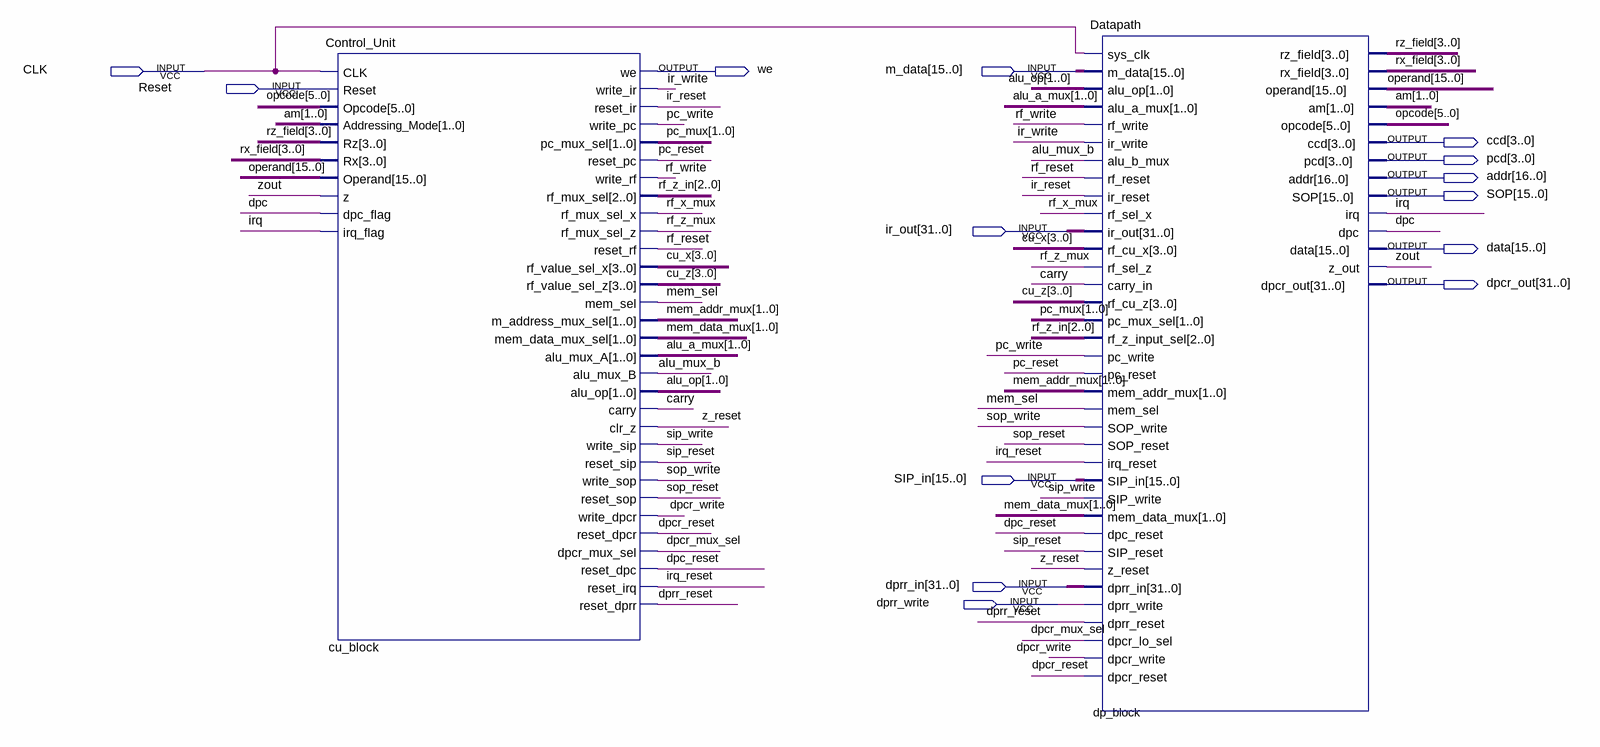
[diagram p0: schematic sheet]
// Quartus schematic ReCOPCore.bdf as structural Verilog: 2 symbols, 14 pins
module ReCOPCore (
  input  CLK,
  input  [15:0] m_data,
  input  Reset,
  input  [31:0] ir_out,
  input  [15:0] SIP_in,
  input  [31:0] dprr_in,
  input  dprr_write,
  output we,
  output [3:0] ccd,
  output [3:0] pcd,
  output [16:0] addr,
  output [15:0] SOP,
  output [15:0] data,
  output [31:0] dpcr_out
);

  wire alu_mux_b, carry, dpc, dpc_reset, dpcr_mux_sel, dpcr_reset, dpcr_write, dprr_reset, ir_reset,
       ir_write, irq, irq_reset, mem_sel, pc_reset, pc_write, rf_reset, rf_write, rf_x_mux, rf_z_mux,
       sip_reset, sip_write, sop_reset, sop_write, z_reset, zout;
  wire [1:0] alu_a_mux, alu_op, am, mem_addr_mux, mem_data_mux, pc_mux;
  wire [2:0] rf_z_in;
  wire [3:0] cu_x, cu_z, rx_field, rz_field;
  wire [5:0] opcode;
  wire [15:0] operand;

  Control_Unit cu_block (
    .CLK(CLK), .Reset(Reset), .Opcode(opcode), .Addressing_Mode(am), .Rz(rz_field), .Rx(rx_field),
    .Operand(operand), .z(zout), .dpc_flag(dpc), .irq_flag(irq), .we(we), .write_ir(ir_write),
    .reset_ir(ir_reset), .write_pc(pc_write), .pc_mux_sel(pc_mux), .reset_pc(pc_reset), .write_rf(rf_write),
    .rf_mux_sel(rf_z_in), .rf_mux_sel_x(rf_x_mux), .rf_mux_sel_z(rf_z_mux), .reset_rf(rf_reset),
    .rf_value_sel_x(cu_x), .rf_value_sel_z(cu_z), .mem_sel(mem_sel), .m_address_mux_sel(mem_addr_mux),
    .mem_data_mux_sel(mem_data_mux), .alu_mux_A(alu_a_mux), .alu_mux_B(alu_mux_b), .alu_op(alu_op),
    .carry(carry), .clr_z(z_reset), .write_sip(sip_write), .reset_sip(sip_reset), .write_sop(sop_write),
    .reset_sop(sop_reset), .write_dpcr(dpcr_write), .reset_dpcr(dpcr_reset), .dpcr_mux_sel(dpcr_mux_sel),
    .reset_dpc(dpc_reset), .reset_irq(irq_reset), .reset_dprr(dprr_reset));
  Datapath dp_block (
    .sys_clk(CLK), .m_data(m_data), .alu_op(alu_op), .alu_a_mux(alu_a_mux), .rf_write(rf_write),
    .ir_write(ir_write), .alu_b_mux(alu_mux_b), .rf_reset(rf_reset), .ir_reset(ir_reset),
    .rf_sel_x(rf_x_mux), .ir_out(ir_out), .rf_cu_x(cu_x), .rf_sel_z(rf_z_mux), .carry_in(carry),
    .rf_cu_z(cu_z), .pc_mux_sel(pc_mux), .rf_z_input_sel(rf_z_in), .pc_write(pc_write), .pc_reset(pc_reset),
    .mem_addr_mux(mem_addr_mux), .mem_sel(mem_sel), .SOP_write(sop_write), .SOP_reset(sop_reset),
    .irq_reset(irq_reset), .SIP_in(SIP_in), .SIP_write(sip_write), .mem_data_mux(mem_data_mux),
    .dpc_reset(dpc_reset), .SIP_reset(sip_reset), .z_reset(z_reset), .dprr_in(dprr_in),
    .dprr_write(dprr_write), .dprr_reset(dprr_reset), .dpcr_lo_sel(dpcr_mux_sel), .dpcr_write(dpcr_write),
    .dpcr_reset(dpcr_reset), .rz_field(rz_field), .rx_field(rx_field), .operand(operand), .am(am),
    .opcode(opcode), .ccd(ccd), .pcd(pcd), .addr(addr), .SOP(SOP), .irq(irq), .dpc(dpc), .data(data),
    .z_out(zout), .dpcr_out(dpcr_out));
endmodule
